# Altium schematic sheet PISO.SchDoc: Rejestry PISO
size A4; Author: Jakub Wiczynski; Revision: 1
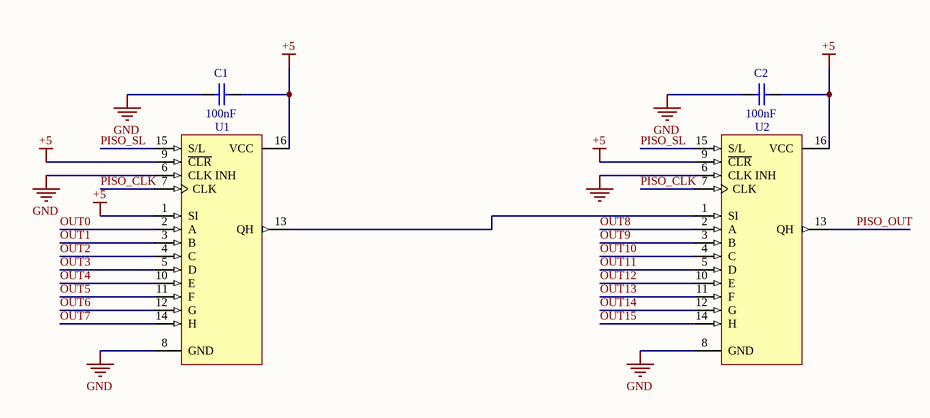
[diagram p0: PISO.SchDoc]

## Parts
C1  value 100nF  [C1206]  (hidden comment: http://www.tme.eu/pl/details/12061c104kat2a/kondensatory-mlcc-smd-1206/avx/)
C2  value 100nF  [C1206]  (hidden comment: http://www.tme.eu/pl/details/12061c104kat2a/kondensatory-mlcc-smd-1206/avx/)
U1  http://www.tme.eu/pl/details/sn74hc166d/rejestry-przesuwne/texas-instruments/  [D016_N]  (value not drawn)
U2  http://www.tme.eu/pl/details/sn74hc166d/rejestry-przesuwne/texas-instruments/  [D016_N]  (value not drawn)

## Nets
+5: C1.2 C2.2 U1.1(SI) U1.9(~{CLR}) U1.16(VCC) U2.9(~{CLR}) U2.16(VCC)
GND: C1.1 C2.1 U1.6(CLK_INH) U1.8(GND) U2.6(CLK_INH) U2.8(GND)
OUT0: U1.2(A)
OUT1: U1.3(B)
OUT2: U1.4(C)
OUT3: U1.5(D)
OUT4: U1.10(E)
OUT5: U1.11(F)
OUT6: U1.12(G)
OUT7: U1.14(H)
OUT8: U2.2(A)
OUT9: U2.3(B)
OUT10: U2.4(C)
OUT11: U2.5(D)
OUT12: U2.10(E)
OUT13: U2.11(F)
OUT14: U2.12(G)
OUT15: U2.14(H)
PISO_CLK: U1.7(CLK) U2.7(CLK)
PISO_OUT: U2.13(QH)
PISO_SL: U1.15(S/L) U2.15(S/L)
NetU1_13: U1.13(QH) U2.1(SI)

## Notes on the sheet
- Title:
- Author:
- Approved by:
- Size:
- A4
- Date:
- Revision:

## Library data of the parts
C1 C2 = Cap: 100nF; Published: 8-Jun-2000; LatestRevisionDate: 17-Jul-2002; LatestRevisionNote: Re-released for DXP Platform.; PackageReference: RAD-0.3; Publisher: Altium Limited; PackageDescription: Radial Cap, Thru-Hole; 2 Leads; 0.3 in Pin Spacing
U1 U2 = SN74HC166D: SN74HC166; Published: 8-Jun-2000; LatestRevisionDate: 13-Apr-2006; LatestRevisionNote: IPC-7351 Footprint Added.; DatasheetVersion: May-1997; PackageVersion: Jan-1998; PackageReference: D016; Publisher: Altium Limited; PackageDescription: 16-Pin Small Outline Integrated Circuit 1.27 mm Pitch; Code_IPC: SOIC127P600-16; ComponentLink1Description: Manufacturer Link; ComponentLink1URL: http://www.ti.com/; ComponentLink2Description: Datasheet; ComponentLink2URL: http://www-s.ti.com/sc/ds/sn74hc166.pdf